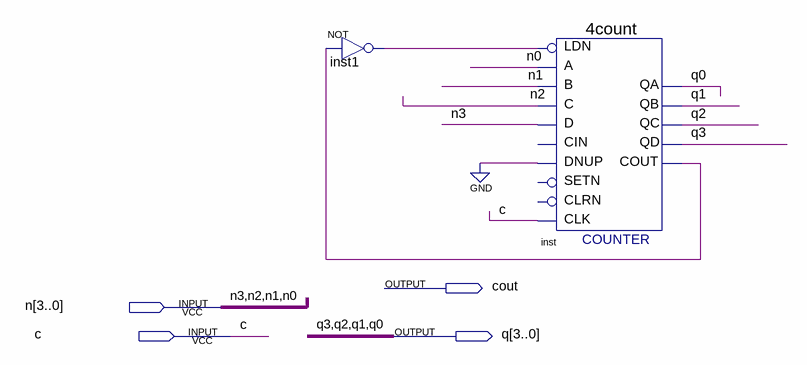
[diagram p0: schematic sheet]
// Quartus schematic s73_div2.bdf as structural Verilog: 2 symbols, 4 pins
module s73_div2 (
  input  [3:0] n,
  input  c,
  output cout,
  output [3:0] q
);

  wire inst1_out, inst_cout;

  not inst1 (inst1_out, inst_cout);
  \4count  inst (
    .LDN(inst1_out), .B(n[1]), .A(n[0]), .D(n[3]), .DNUP(1'b0), .CLK(c), .C(n[2]), .QA(q[0]), .QB(q[1]),
    .QC(q[2]), .QD(q[3]), .COUT(inst_cout));  // open: CIN, SETN, CLRN
endmodule
